# Altium project instrumentation-amplifier.PrjPcb
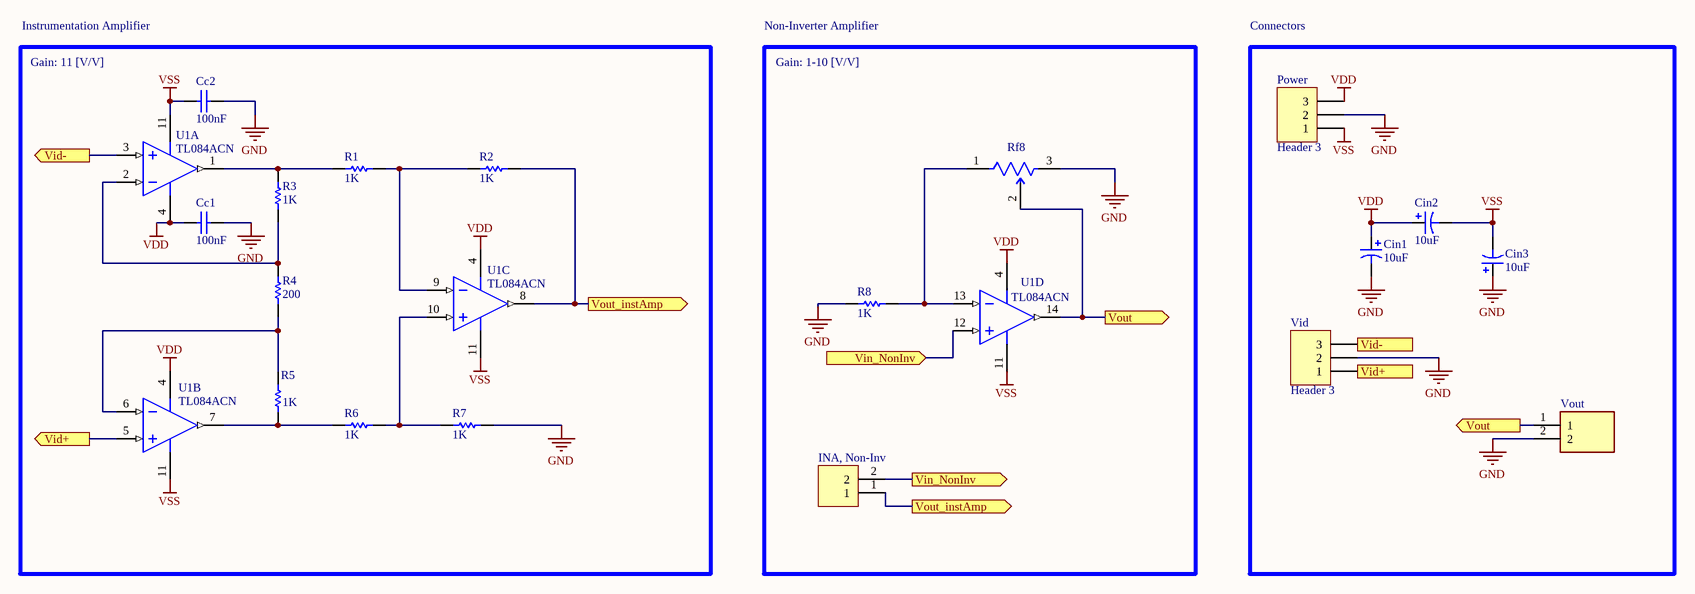
[diagram p0: instrumentation-amplifier.SchDoc]
1 sheet, 19 parts. Net scope: flat (ports and power ports of the same name join across sheets).
Board file: Instrumentation-Amplifier.PcbDoc

## Sheet instrumentation-amplifier.SchDoc: Instrumentation Amplifier
size Legal; Author: Philippe Groulx-Létourneau; DrawnBy: Philippe Groulx-Létourneau; SheetNumber: 1; SheetTotal: 1; SPICEModelCacheSUBIPHUQ: <root> / <DocumentId>SUBIPHUQ</DocumentId> / </root>

### Parts
Cc1  value 100nF  [condensateur 0.1uf 100mil]  (hidden comment: Cap)
Cc2  value 100nF  [condensateur 0.1uf 100mil]  (hidden comment: Cap)
Cin1  value 10uF  [RB7.6-15]  (hidden comment: Cap Pol1)
Cin2  value 10uF  [RB7.6-15]  (hidden comment: Cap Pol1)
Cin3  value 10uF  [RB7.6-15]  (hidden comment: Cap Pol1)
INA,_Non-Inv  Jumper  [Header 2P 100mil]  (value not drawn)
Power  Header 3  [MTA_3M]
R1  value 1K  [Resistor_Axial 0.4]  (hidden comment: Res1)
R2  value 1K  [Resistor_Axial 0.4]  (hidden comment: Res1)
R3  value 1K  [Resistor_Axial 0.4]  (hidden comment: Res1)
R4  value 200  [Resistor_Axial 0.4]  (hidden comment: Res1)
R5  value 1K  [Resistor_Axial 0.4]  (hidden comment: Res1)
R6  value 1K  [Resistor_Axial 0.4]  (hidden comment: Res1)
R7  value 1K  [Resistor_Axial 0.4]  (hidden comment: Res1)
R8  value 1K  [Resistor_Axial 0.4]  (hidden comment: Res1)
Rf8  67WR100KLF  [FP-67W-MFG]  (value not drawn)
U1  TL084ACN  [N0014A]  (parts A,B,C,D of 4)
Vid  Header 3  [MTA_3M]
Vout  640456-2  [TE_640456-2]  (value not drawn)

### Blocks framed on the sheet
Connectors: Cin1-Cin3 Power Vid Vout

### Ports
Vid+ (in, see instrumentation-amplifier[1C]), Vid+ (out, see instrumentation-amplifier[4C]), Vid- (in, see instrumentation-amplifier[1B]), Vid- (out, see instrumentation-amplifier[4C]), Vin_NonInv (in, see instrumentation-amplifier[3C]), Vin_NonInv (out, see instrumentation-amplifier[2C]), Vout (out, see instrumentation-amplifier[3B]), Vout (out, see instrumentation-amplifier[4C]), Vout_instAmp (out, see instrumentation-amplifier[2B]), Vout_instAmp (out, see instrumentation-amplifier[3C])

### Nets
GND: Cc1.2 Cc2.2 Cin1.2 Cin3.1 Power.2 R7.1 R8.2 Rf8.3 Vid.2 Vout.2
VDD: Cc1.1 Cin1.1 Cin2.1 Power.3 U1.4(VCC+)
VSS: Cc2.1 Cin2.2 Cin3.2 Power.1 U1.11(VCC-)
NetINA,_Non-Inv_1: INA,_Non-Inv.1 R2.1 U1.8(OUT3) ; port Vout_instAmp
NetINA,_Non-Inv_2: INA,_Non-Inv.2 U1.12(IN4+) ; port Vin_NonInv
NetR1_1: R1.1 R2.2 U1.9(IN3-)
NetR1_2: R1.2 R3.2 U1.1(OUT1)
NetR3_1: R3.1 R4.2 U1.2(IN1-)
NetR4_1: R4.1 R5.2 U1.6(IN2-)
NetR5_1: R5.1 R6.2 U1.7(OUT2)
NetR6_1: R6.1 R7.2 U1.10(IN3+)
NetR8_1: R8.1 Rf8.1 U1.13(IN4-)
NetRf8_2: Rf8.2 U1.14(OUT4) Vout.1 ; port Vout
NetU1_3: U1.3(IN1+) Vid.3 ; port Vid-
NetU1_5: U1.5(IN2+) Vid.1 ; port Vid+

### Notes on the sheet
- Instrumentation Amplifier
- Non-Inverter Amplifier
- Gain: 11 [V/V]
- Gain: 1-10 [V/V]

### Library data of the parts
Cc1 Cc2 = Cap: Capacitor; Published: 8-Jun-2000; LatestRevisionDate: 17-Jul-2002; LatestRevisionNote: Re-released for DXP Platform.; PackageReference: RAD-0.3; Publisher: Altium Limited; PackageDescription: Radial Cap, Thru-Hole; 2 Leads; 0.3 in Pin Spacing
Cin1-Cin3 = Cap Pol1: Polarized Capacitor (Radial); Published: 8-Jun-2000; LatestRevisionDate: 17-Jul-2002; LatestRevisionNote: Re-released for DXP Platform.; PackageReference: RB7.6-15; Publisher: Altium Limited; PackageDescription: Polarized Capacitor (Radial); 2 Leads
INA,_Non-Inv = header 2 pin_UL: LatestRevisionDate: 17-Jul-2002; LatestRevisionNote: Re-released for DXP Platform.; Publisher: Altium Limited; Digikey: 732-5315-ND
Power Vid = Header 3: Header, 3-Pin; LatestRevisionDate: 17-Jul-2002; LatestRevisionNote: Re-released for DXP Platform.; Publisher: Altium Limited
R1-R8 = Res1: Resistor; Published: 8-Jun-2000; LatestRevisionDate: 17-Jul-2002; LatestRevisionNote: Re-released for DXP Platform.; PackageReference: AXIAL-0.3; Publisher: Altium Limited; PackageDescription: Axial Device, Thru-Hole; 2 Leads; 0.3 in Pin Spacing
Rf8 = CMP-50449-000002-1: TRIMMER 100K OHM 0.5W PC PIN TOP; Power Rating: 500mW; Temperature Coefficient: 100ppm/°C; Number of Turns: 20; Voltage Rating: 200V; Resistance: 100kR; Tolerance: 10%; Radiation Hardening: No; Min Operating Temperature: -55°C; Packaging: Bulk; Depth: 4.95mm; Resistor Type: Cermet; Mount: Through Hole; Max Power Dissipation: 500mW; Package Quantity: 100; Length: 9.53mm; REACH SVHC: No SVHC; Voltage Rating (DC): 200V; Series: 67; Height: 0.409inch; Type: Potentiometer; Weight: 1.1g; RoHS Compliant: Yes; Technology: CERMET; Lead Free: Lead Free; Termination: Pin; Resistance Tolerance: 10%; Max Operating Temperature: 125°C; Military Standard: Not
U1 = CMP-0017-00814-2: JFET-Input Operational Amplifier, 7 to 36 V, 0 to 70 degC, 14-pin DIP (N14), Pb-Free (RoHS); Manufacturer: Texas Instruments; Sub Family: General Purpose Amplifier, High Supply Voltage Amplifier (>=30V); Slew Rate(Typ)(V/us): 13; Offset Drift(Typ)(uV/C): 18; GBW(Typ)(MHz): 3; Number of Channels: 4; Rating: Catalog; Total Supply Voltage(Max)(+5V is 5, +/-5V is 10): 36; Vio (25C)(Max)(mV): 6; IIB(Max)(pA): 200; CMRR(Min)(dB): 75; Total Supply Voltage(Min)(+5V is 5, +/-5V is 10): 7; Iq per channel(Max)(mA): 2.8; PackageReference: N0014A; ComponentLink1Description: Manufacturer URL; ComponentLink1URL: http://www.ti.com/; Code_JEDEC: MS-001; PackageVersion: 4040049/E, 12/2002; Mounting Technology: Through Hole; PackageDescription: 14-Pin Plastic In-Line, Body 19.305 x 6.35 mm, Pitch 2.54 mm; ComponentLink2URL: http://www.ti.com/lit/ds/symlink/tl084a.pdf; Vn at 1kHz(Typ)(nV/rtHz): 18; DatasheetVersion: SLOS081G; ComponentLink3Description: Package Specification; ComponentLink3URL: http://www.ti.com/lit/ml/mpdi002c/mpdi002c.pdf; PartNumber: TL084ACN; Eco-Plan: Pb-Free (RoHS); ComponentLink2Description: Datasheet
Vout = 640456-2: Header Friction Lock MTA-100 2 250 VAC Polyester Tin Copper Alloy Tin | TE Connectivity 640456-2; SnapEDA_Link: https://www.snapeda.com/parts/640456-2/TE+Connectivity+AMP+Connectors/view-part/?ref=snap; Package: None; Value: *; MF: TE Connectivity; MP: 640456-2; Check_prices: https://www.snapeda.com/parts/640456-2/TE+Connectivity+AMP+Connectors/view-part/?ref=eda